# Altium schematic sheet S7CAS-PLEIADES-CARTE-MERE_P06_FLASH.SCHDOC
size Tabloid; SheetNumber: 15; SheetTotal: 18; Sheet_Name: FLASH; Size: 11x17
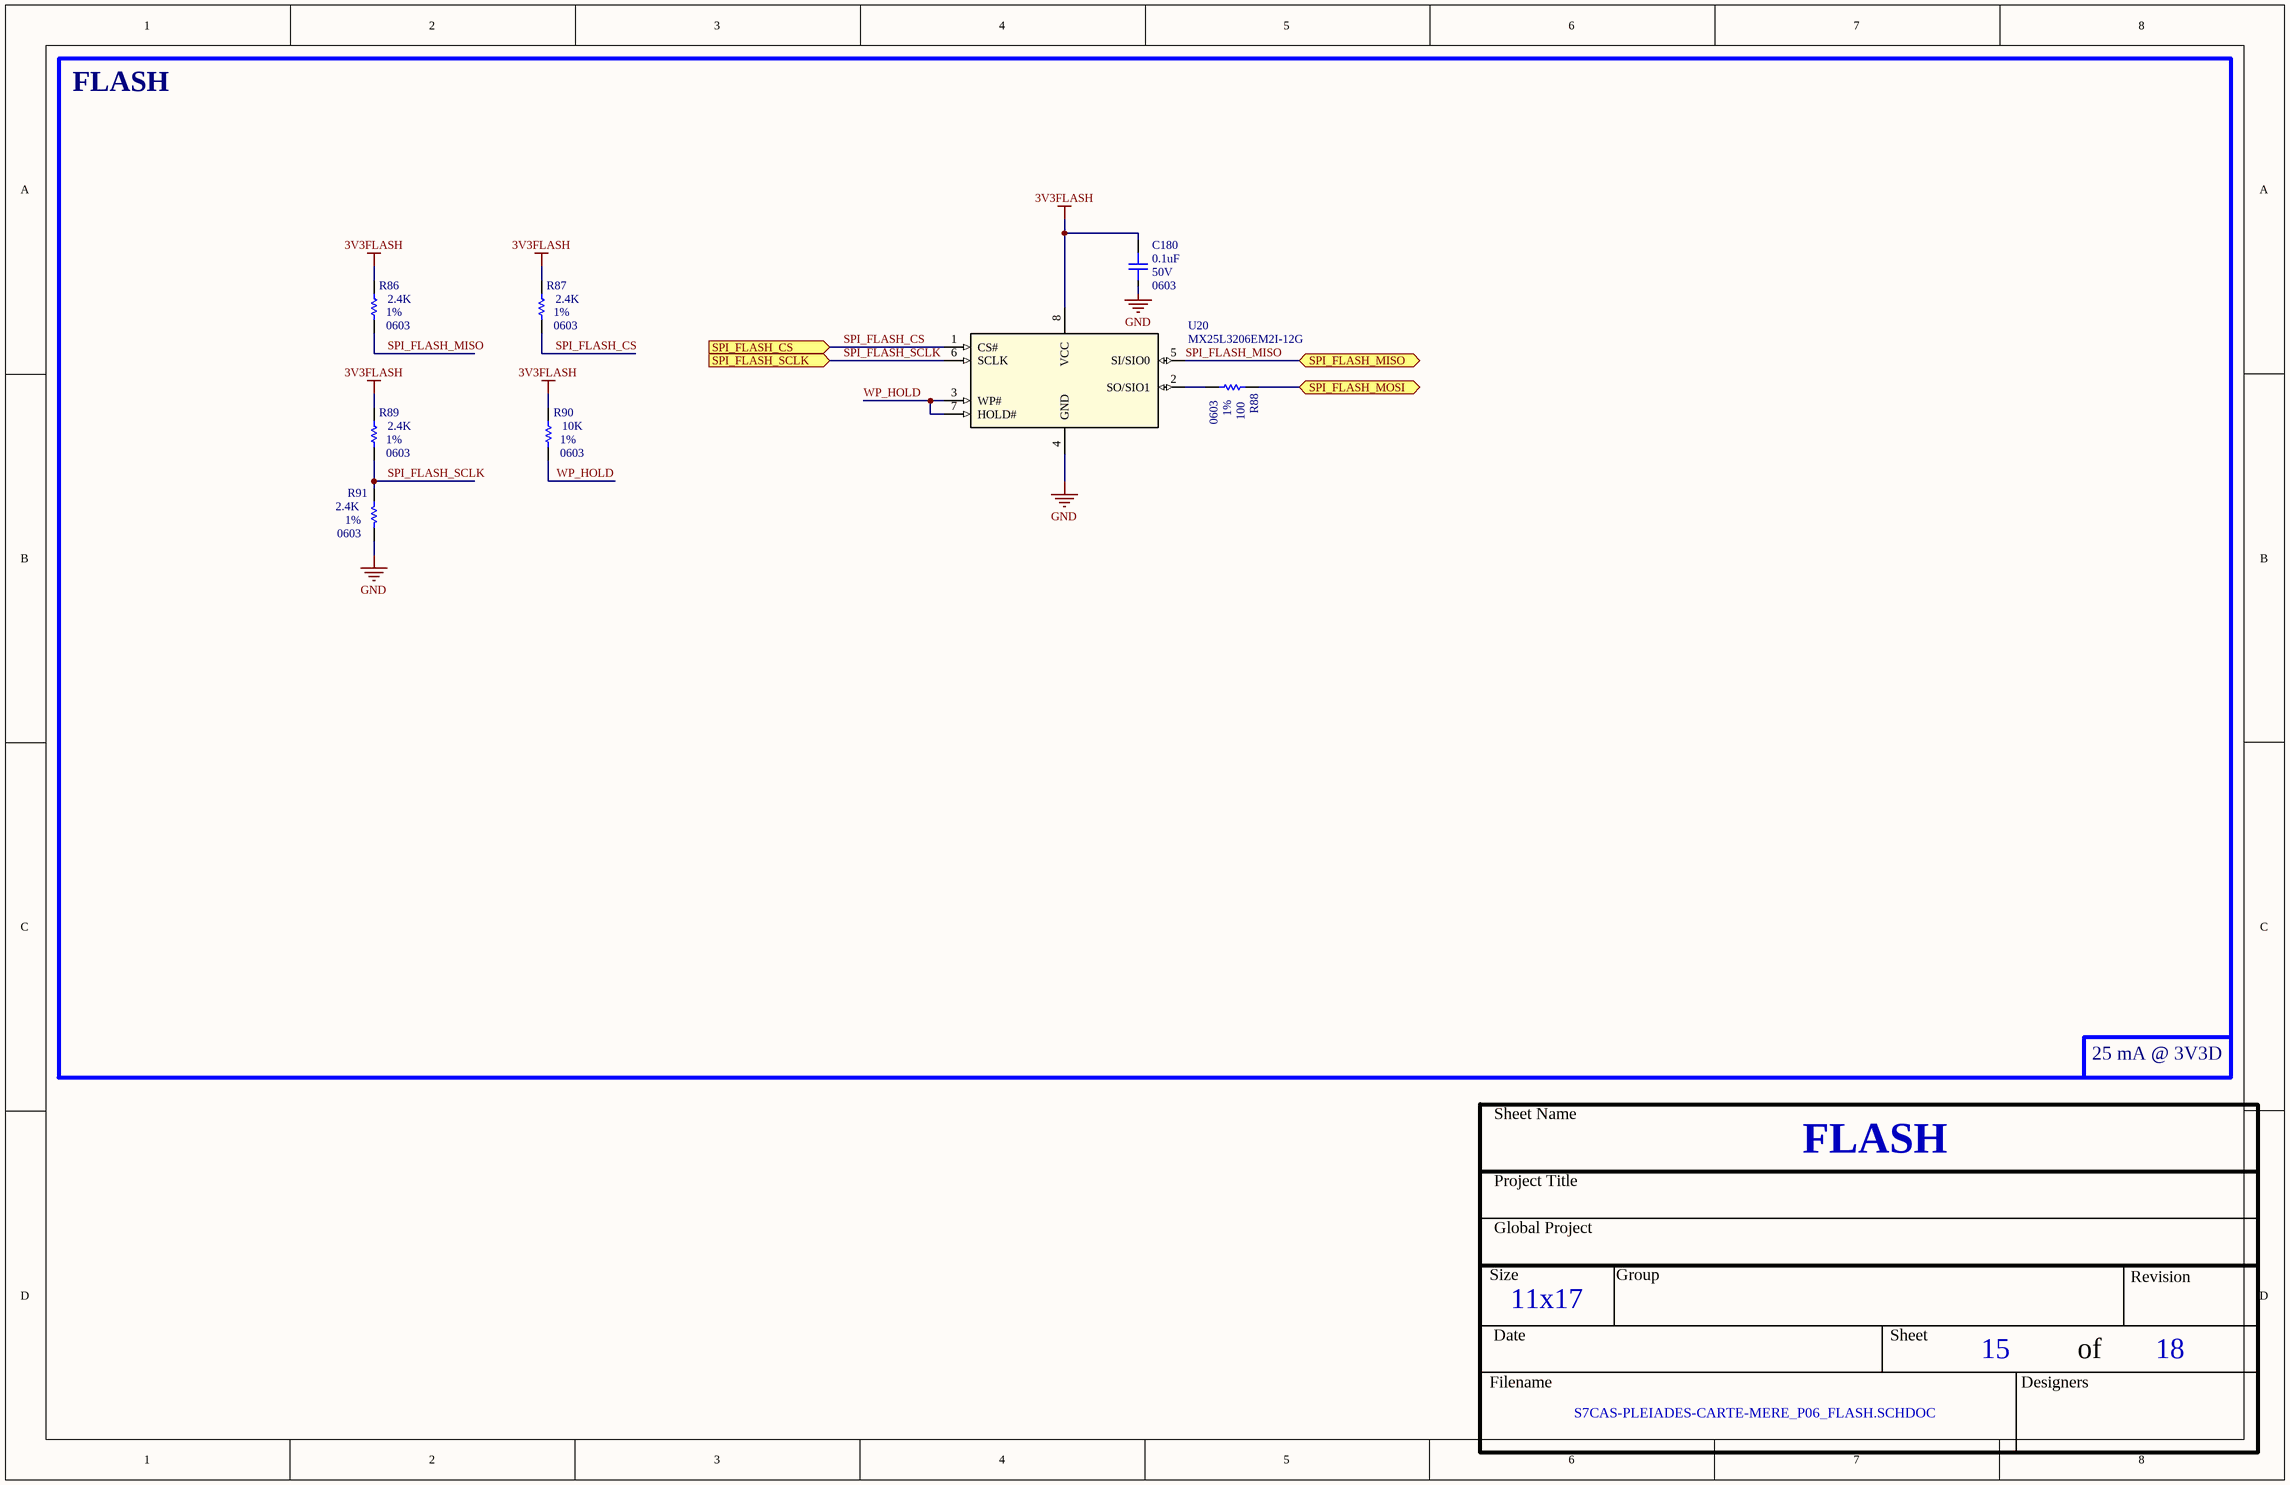
[diagram p0: S7CAS-PLEIADES-CARTE-MERE_P06_FLASH.SCHDOC]

## Parts
C180  value 0.1uF  Voltage: 50V  Package: 0603  [CAP_0603]  (hidden comment: CAP - 0603)
R86  value 2.4K  Package: 0603  Precision: 1%  [RES_0603]  (hidden comment: RES - 0603)
R87  value 2.4K  Package: 0603  Precision: 1%  [RES_0603]  (hidden comment: RES - 0603)
R88  value 100  Package: 0603  Precision: 1%  [RES_0603]  (hidden comment: RES - 0603)
R89  value 2.4K  Package: 0603  Precision: 1%  [RES_0603]  (hidden comment: RES - 0603)
R90  value 10K  Package: 0603  Precision: 1%  [RES_0603]  (hidden comment: RES - 0603)
R91  value 2.4K  Package: 0603  Precision: 1%  [RES_0603]  (hidden comment: RES - 0603)
U20  MX25L3206EM2I-12G  [SOP8L_200MIL_6110-1406_MAC]

## Blocks framed on the sheet
FLASH: C180 R86-R91 U20

## Ports
SPI_FLASH_CS (in, see S7CAS-PLEIADES-CARTE-MERE_P06_FPGA2[3C]), SPI_FLASH_MISO (bidir, see S7CAS-PLEIADES-CARTE-MERE_P06_FPGA2[1A]), SPI_FLASH_MOSI (bidir, see S7CAS-PLEIADES-CARTE-MERE_P06_FPGA2[1A]), SPI_FLASH_SCLK (in, see S7CAS-PLEIADES-CARTE-MERE_P06_FPGA2[1A])

## Nets
3V3FLASH: C180.2 R86.2 R87.2 R89.2 R90.2 U20.8(VCC)
GND: C180.1 R91.1 U20.4(GND)
SPI_FLASH_CS: R87.1 U20.1(CS#) ; port SPI_FLASH_CS
SPI_FLASH_MISO: R86.1 U20.5(SI/SIO0) ; port SPI_FLASH_MISO
SPI_FLASH_MOSI: R88.2 ; port SPI_FLASH_MOSI
SPI_FLASH_SCLK: R89.1 R91.2 U20.6(SCLK) ; port SPI_FLASH_SCLK
WP_HOLD: R90.1 U20.3(WP#) U20.7(HOLD#)
NetR88_1: R88.1 U20.2(SO/SIO1)

## Notes on the sheet
- 25 mA @ 3V3D
- Sheet Name
- Project Title
- Global Project
- Size
- Group
- Revision
- Date
- Sheet
- of
- Filename
- Designers

## Library data of the parts
C180 = CAP - 0603: Precision: 10%; Current: *; CreatedBy: Jonathan Bouchard; Power: *
U20 = MX25L3206EM2I-12G: Description; Manufacturer_Name: Macronix; Copyright: Copyright (C) 2025 Ultra Librarian. All rights reserved.; Manufacturer_Part_Number: MX25L3206EM2I-12G; RefDes: RefDes; Type: Type
R86-R91 = RES - 0603: Current: *; CreatedBy: Jonathan Bouchard